# EasyEDA schematic SCH_DS3231SupercapModule_2025-05-23.json
TITLE: Sheet_1; REV: 1.0; Date: 2025-05-19; Sheet: 1/1; Drawn By: kirill.poznyak; Company: Your Company
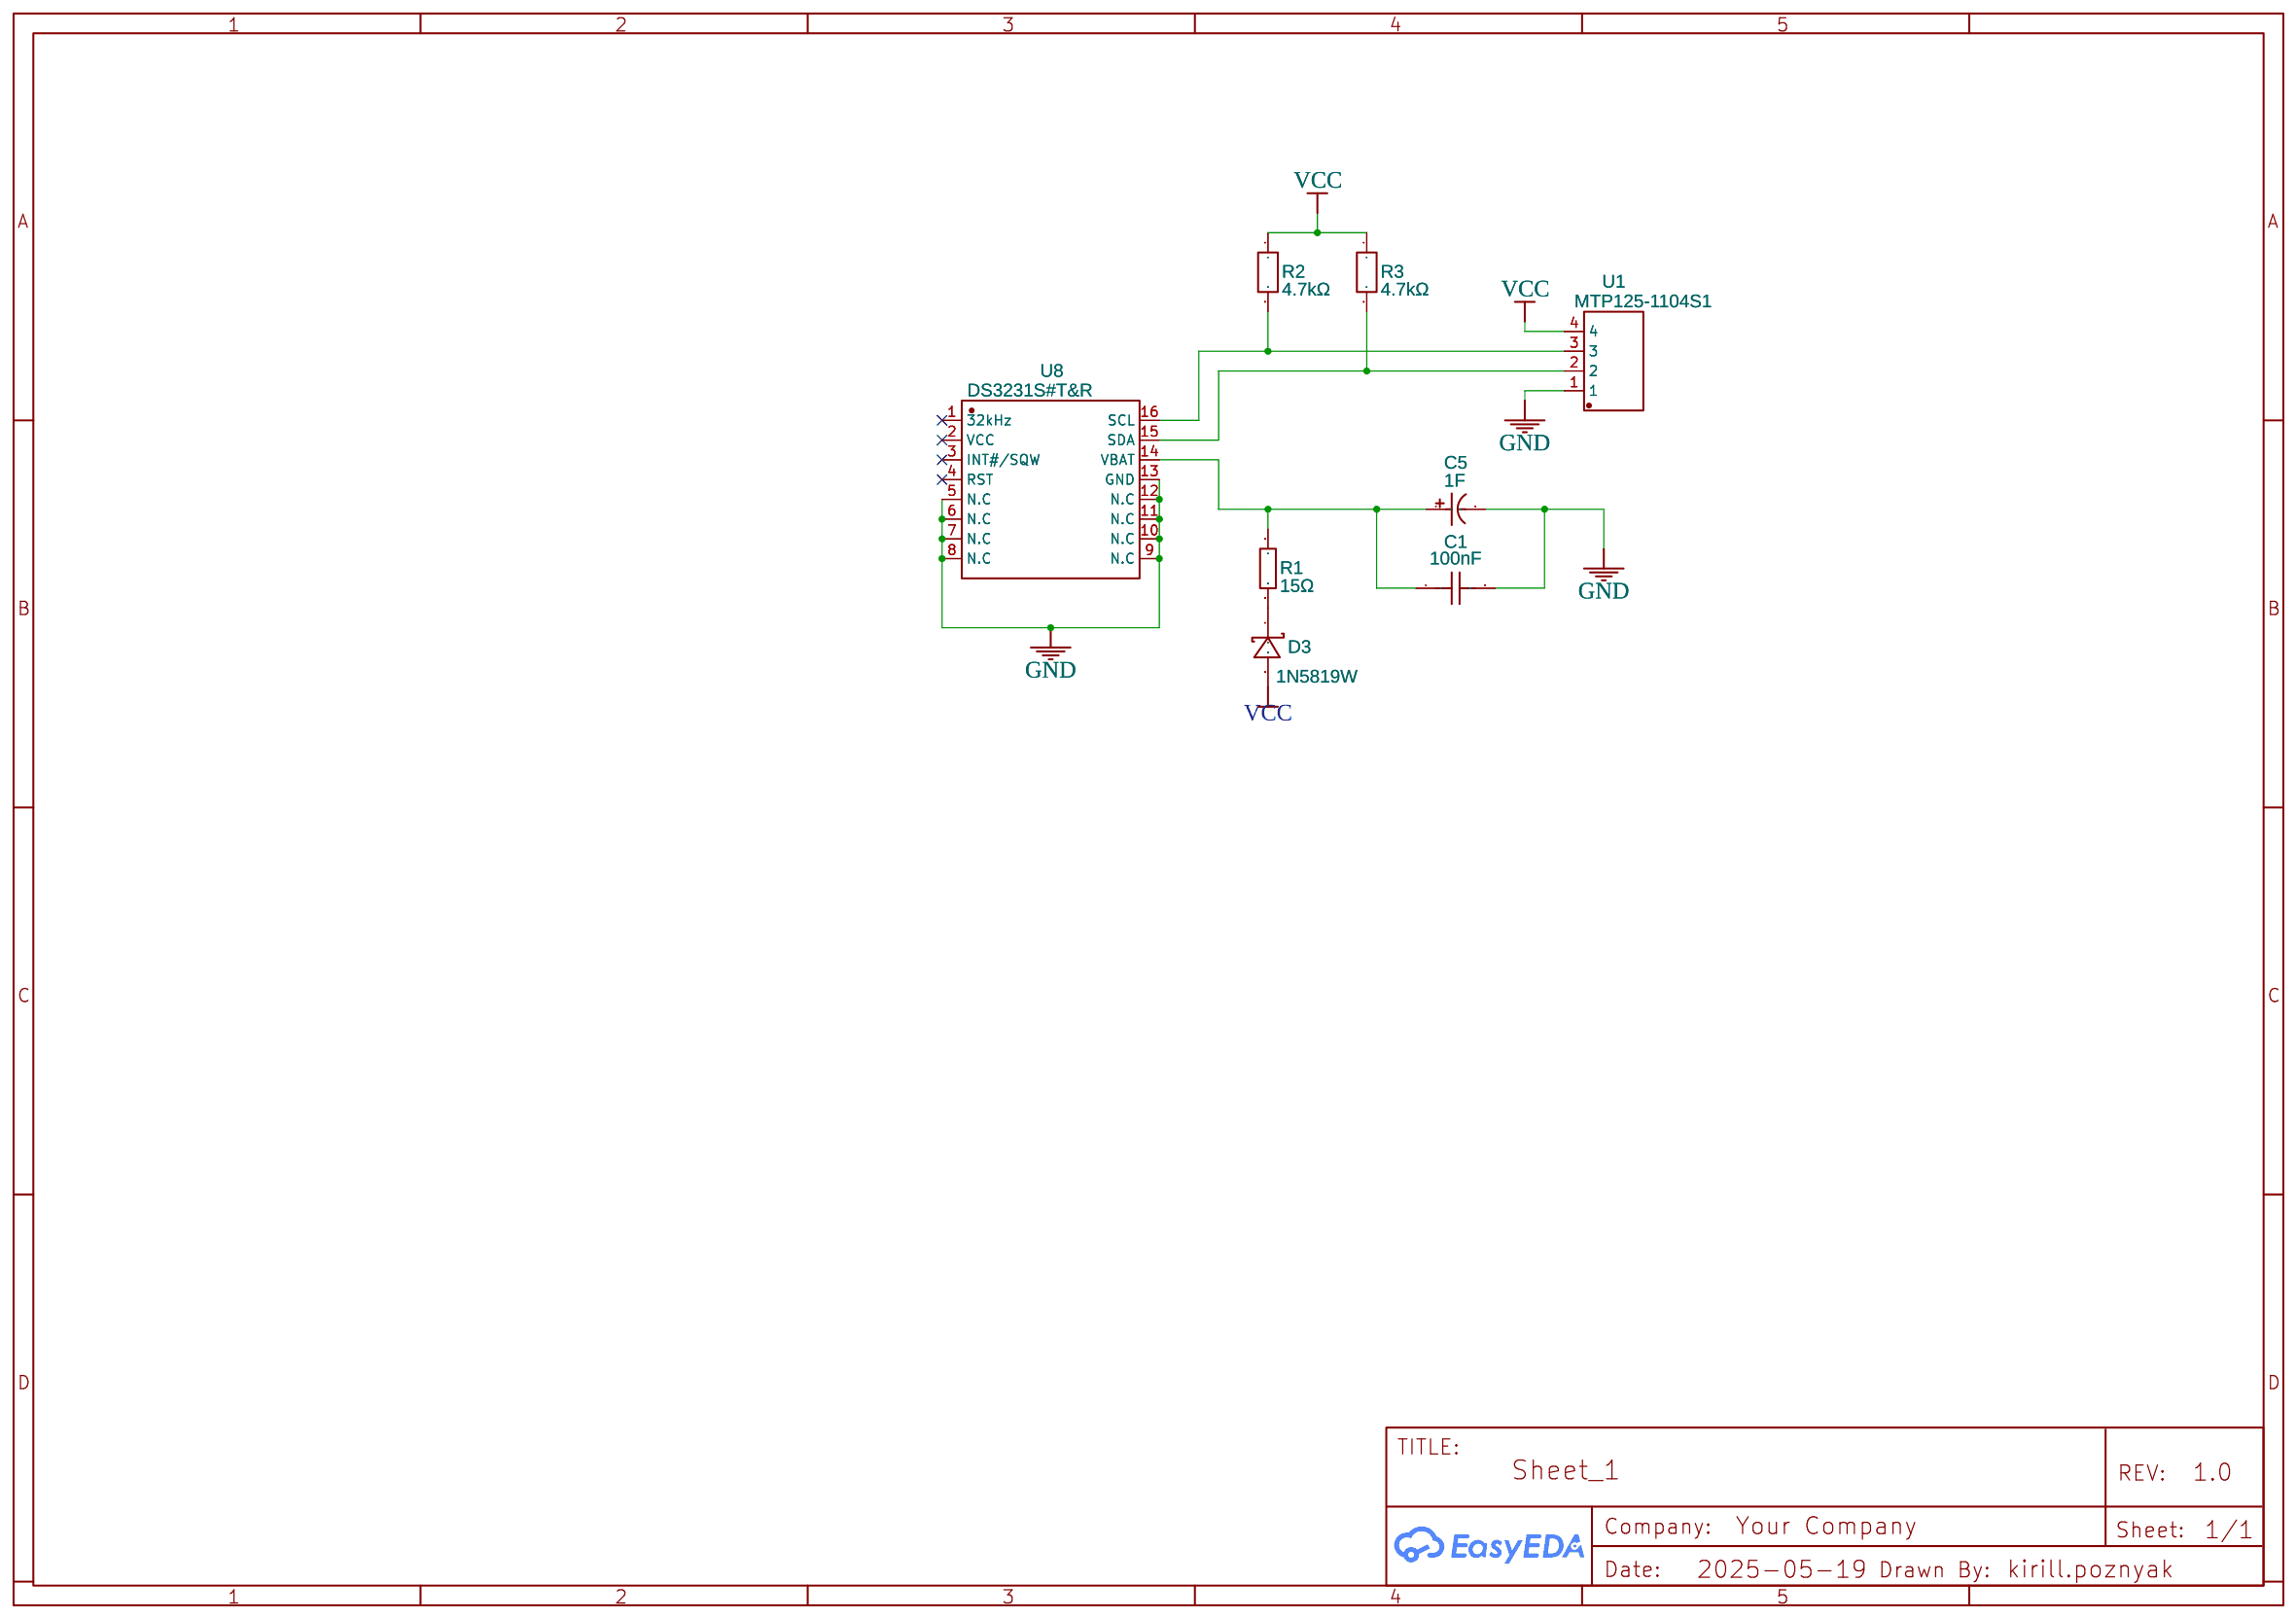
[diagram p0: schematic sheet]

## Parts
C1  100nF  [C0805]
C5  1F  [CAP-TH_BD21.5-P5.00-D1.2-FD]
D3  1N5819W  [SOD-123F_L2.8-W1.8-LS3.7-RD]
R1  15Ω  [R0805]
R2  4.7kΩ  [R0805]
R3  4.7kΩ  [R0805]
U1  MTP125-1104S1  [HDR-TH_4P-P2.54-V-M]
U8  DS3231S#T&R  [SOIC-16_L10.3-W7.5-P1.27-LS10.3-BL]

## Library data of the parts
C1 = 0805B104M500NT: Contributor: LCSC; Supplier: LCSC; Supplier Part: C286511; Manufacturer: FH(风华); JLCPCB Part Class: Extended Part
C5 = DCL5R5105CF: Contributor: LCSC; Supplier: LCSC; Supplier Part: C396468; Manufacturer: KORCHIP(高奇普); JLCPCB Part Class: Extended Part
D3 = 1N5819W: Contributor: LCSC; Supplier: LCSC; Supplier Part: C169540; Manufacturer: 晶导微电子; JLCPCB Part Class: Extended Part
R1 = CR0805J80150G: Supplier: LCSC; Manufacturer: LIZ(丽智电子); Supplier Part: C101942; JLCPCB Part Class: Extended Part
R2 R3 = RT0805BRD074K7L: Supplier: LCSC; Supplier Part: C865532; Manufacturer: YAGEO(国巨); JLCPCB Part Class: Extended Part; Contributor: lcsc
U1 = MTP125-1104S1: Contributor: LCSC; Supplier: LCSC; Supplier Part: C358686; Manufacturer: MINTRON(明硕); JLCPCB Part Class: Extended Part
U8 = DS3231S#T&amp;R: Contributor: LCSC; Supplier: LCSC; Supplier Part: C2651514; Manufacturer: ADI(亚德诺)/MAXIM(美信); JLCPCB Part Class: Extended Part

## Nets
GND: C1.2 C5.2 U1.1 U8.5(N.C) U8.6(N.C) U8.7(N.C) U8.8(N.C) U8.9(N.C) U8.10(N.C) U8.11(N.C) U8.12(N.C) U8.13(GND)
VCC: D3.2 R2.1 R3.1 U1.4
Net-(C1-1): C1.1 C5.1 R1.1 U8.14(VBAT)
Net-(D3-1): D3.1 R1.2
Net-(R2-2): R2.2 U1.3 U8.16(SCL)
Net-(R3-2): R3.2 U1.2 U8.15(SDA)

Not connected (* = marked no-connect by the designer): U8 1(32kHz)* 2(VCC)* 3(INT#/SQW)* 4(RST)*
